# EAGLE design atsha204-breakout (EAGLE 6.3)
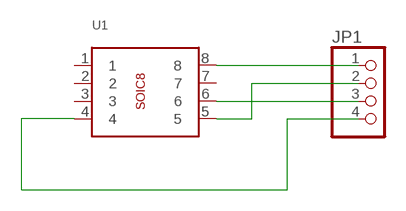
[diagram p0: schematic, sheet 1]

## Parts
JP1  HEADER-1X4  [1X04_OVAL]
U1  BREAKOUT_SOIC8  [BREAKOUT_SOIC8]

## Nets
N$1: JP1.4 U1.4
N$2: JP1.1 U1.8
N$3: JP1.3 U1.6
N$4: JP1.2 U1.5
Unconnected: U1.1 U1.2 U1.3 U1.7

## Library data of the parts
JP1 = microbuilder:HEADER-1X4: PIN HEADER
U1 = microbuilder:BREAKOUT_SOIC8: SOIC8 IC Breakout

## Board
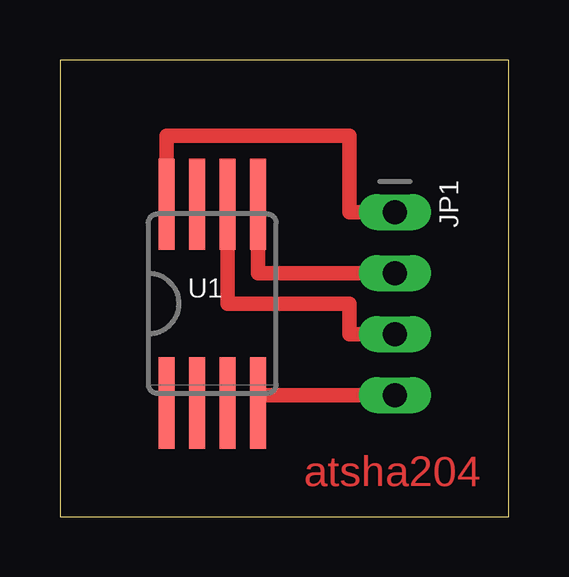
[diagram p1: board, top side]

Size 18.72 x 19.04 mm. Coordinates in mm from the lower left corner, seen from the top.
Outline: 0,0 18.72,0 18.72,19.04 0,19.04 0,0
Copper layers (1*16): Top 0.035mm / dielectric 1.5mm / Bottom 0.035mm
Design rules "default": minimum track width 10mil, minimum drill 24mil, track to track 8mil, track to pad 8mil, pad to pad 8mil, via to via 8mil, smd to smd 8mil, copper to edge 40mil, drill to drill 8mil, minimum pad ring 10mil, minimum via ring 8mil, stop-mask expansion 4mil, vias tented up to drill 0mil, thermal gap 10mil

### Footprints (pad centres in the part's own frame; a part is rotated, then mirrored left to right if it is on the bottom)
1X04_OVAL = drill 1 long: 1 -3.81,0; 2 -1.27,0; 3 1.27,0; 4 3.81,0
BREAKOUT_SOIC8 = smd 0.66 x 3.81: 1 -1.905,-4.14; 2 -0.635,-4.14; 3 0.635,-4.14; 4 1.905,-4.14; 5 1.905,4.14; 6 0.635,4.14; 7 -0.635,4.14; 8 -1.905,4.14

### Placement (x,y rotation side)
JP1  13.97,8.89 270 top
U1  6.35,8.89 0 top

### Tracks (layer width: path | path; a pad name or v marks a point on that pad's centre or on a via)
N$1
  Top 0.61: JP1.4 8.26,5.08 U1.4
N$2
  Top 0.61: U1.8 4.45,15.88 12.06,15.88 12.06,12.7 JP1.1
N$3
  Top 0.61: U1.6 6.99,8.89 12.06,8.89 12.06,7.62 JP1.3
N$4
  Top 0.61: U1.5 8.26,10.16 JP1.2

### Text on the board
Top: atsha204